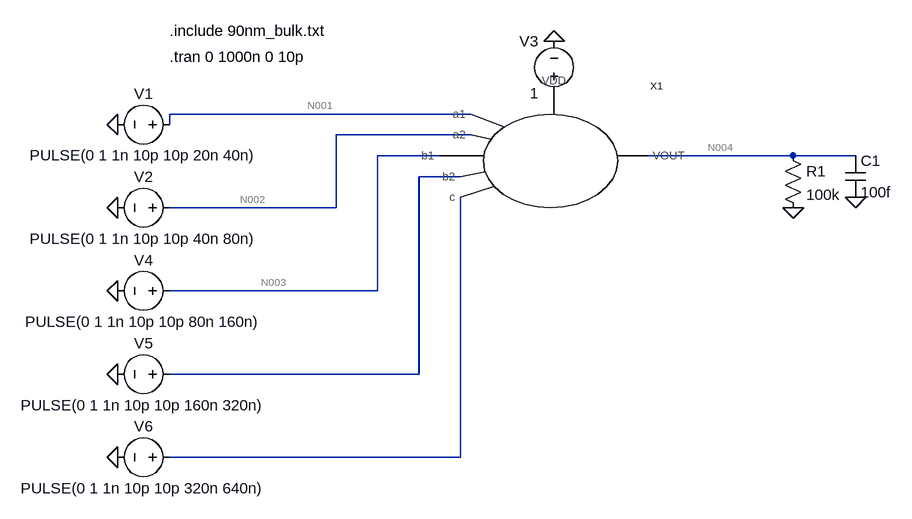
[diagram p0: schematic testcontroller.asc]
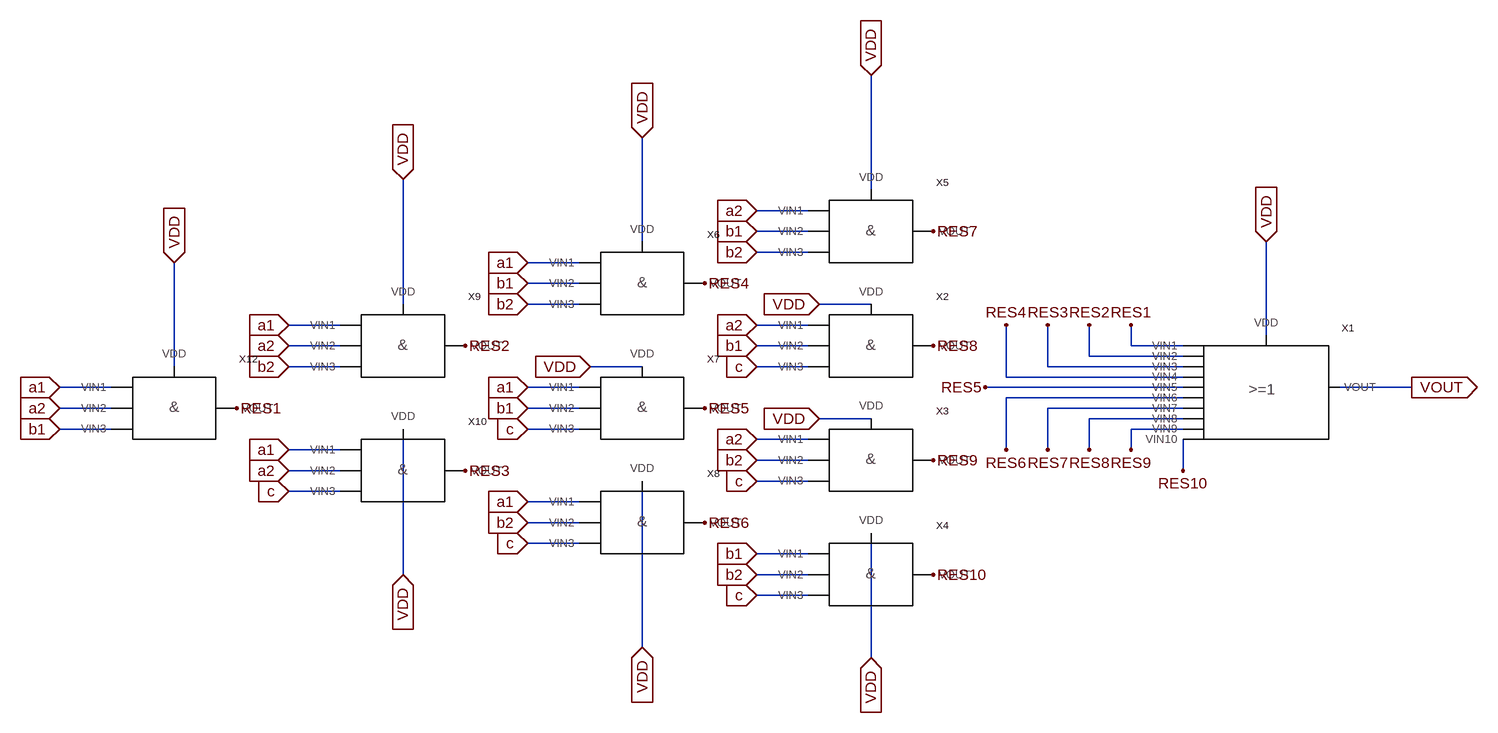
[diagram p1: sub-circuit dimamajorcontroller.asc]
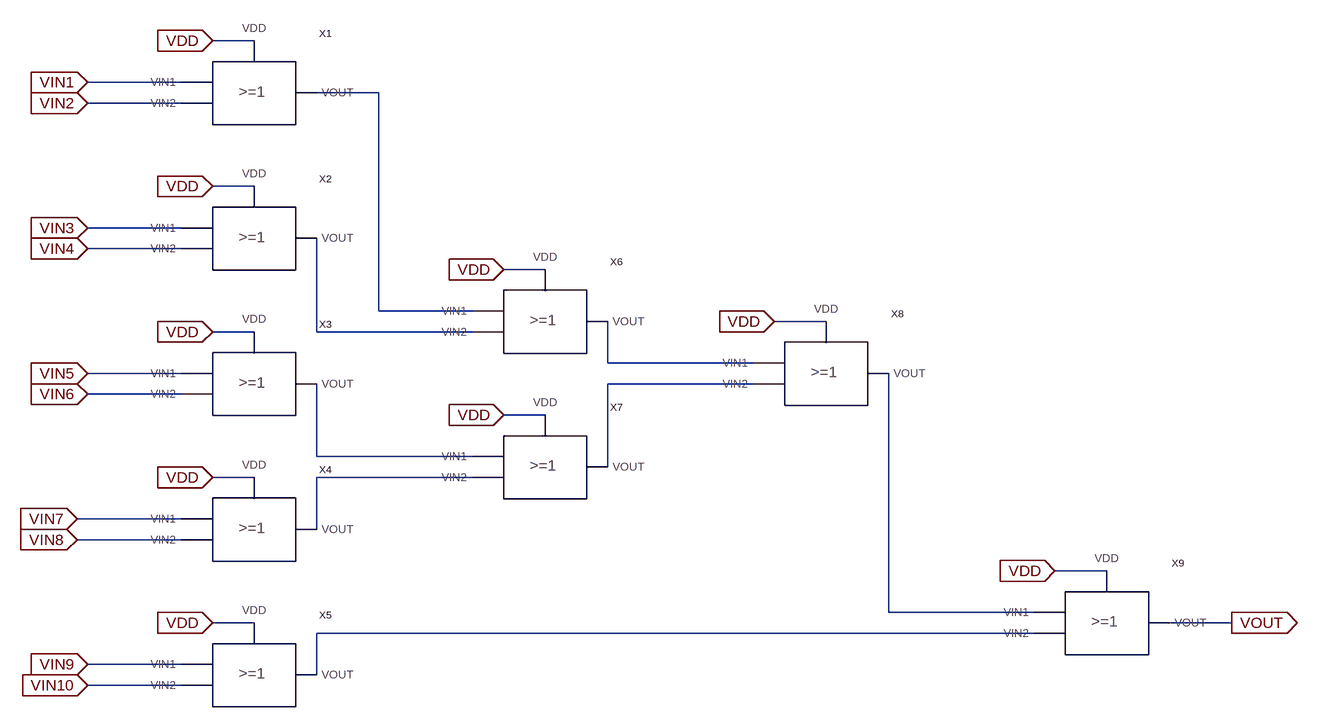
[diagram p2: sub-circuit dimatenor.asc]
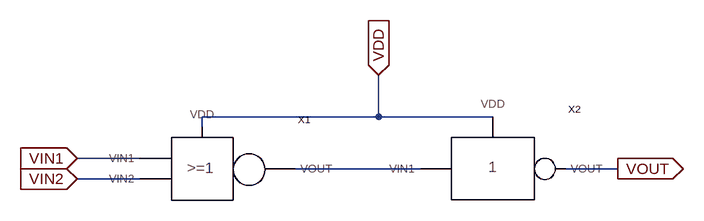
[diagram p3: sub-circuit dimaor.asc]
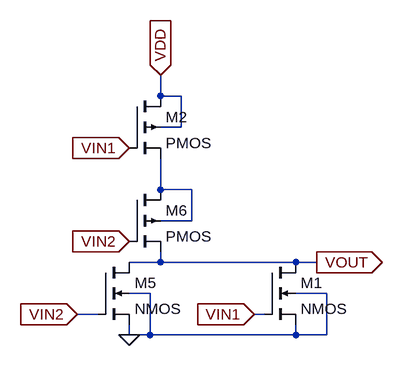
[diagram p4: sub-circuit dimanor.asc]
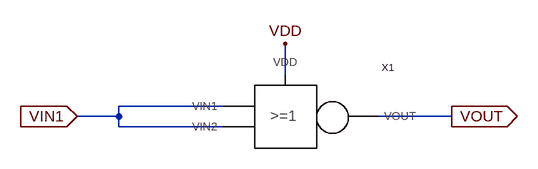
[diagram p5: sub-circuit dimanot.asc]
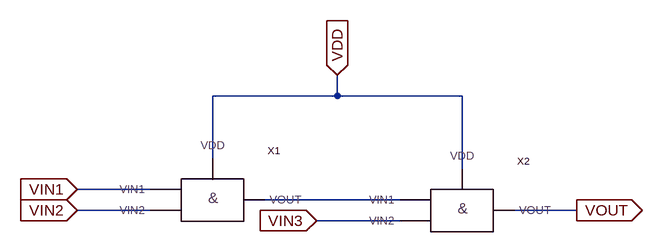
[diagram p6: sub-circuit dimatripleand.asc]
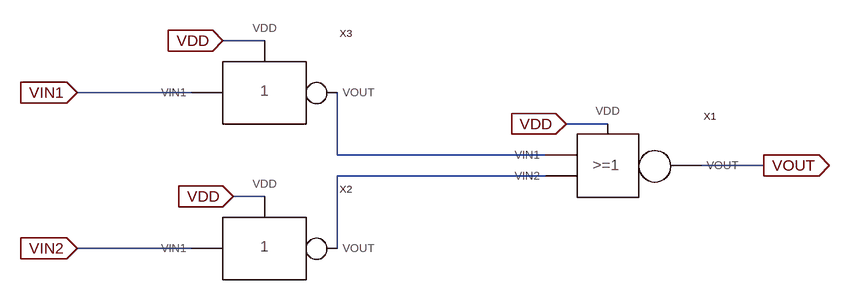
[diagram p7: sub-circuit dimaand.asc]
testcontroller.asc, the LTspice schematic file:
Version 4
SHEET 1 960 784
WIRE 304 128 -160 128
WIRE -160 144 -160 128
WIRE 304 160 96 160
WIRE 256 192 160 192
WIRE 800 192 576 192
WIRE 896 192 800 192
WIRE 288 224 224 224
WIRE 96 272 96 160
WIRE 96 272 -160 272
WIRE 160 400 160 192
WIRE 160 400 -160 400
WIRE 224 528 224 224
WIRE 224 528 -160 528
WIRE 288 656 288 256
WIRE 288 656 -160 656
FLAG -240 144 0
FLAG -240 272 0
FLAG 432 16 0
FLAG 800 272 0
FLAG 896 256 0
FLAG -240 400 0
FLAG -240 528 0
FLAG -240 656 0
SYMBOL voltage -144 144 R90
WINDOW 0 -32 56 VBottom 2
WINDOW 3 32 56 VTop 2
WINDOW 123 0 0 Left 0
WINDOW 39 0 0 Left 0
SYMATTR InstName V1
SYMATTR Value PULSE(0 1 1n 10p 10p 20n 40n)
SYMBOL voltage -144 272 R90
WINDOW 0 -32 56 VBottom 2
WINDOW 3 32 56 VTop 2
WINDOW 123 0 0 Left 0
WINDOW 39 0 0 Left 0
SYMATTR InstName V2
SYMATTR Value PULSE(0 1 1n 10p 10p 40n 80n)
SYMBOL voltage 432 112 R180
WINDOW 0 24 96 Left 2
WINDOW 3 24 16 Left 2
WINDOW 123 0 0 Left 0
WINDOW 39 0 0 Left 0
SYMATTR InstName V3
SYMATTR Value 1
SYMBOL cap 880 192 R0
SYMATTR InstName C1
SYMATTR Value 100f
SYMBOL res 784 176 R0
SYMATTR InstName R1
SYMATTR Value 100k
SYMBOL dimamajorcontroller 432 192 R0
SYMATTR InstName X1
SYMBOL voltage -144 400 R90
WINDOW 0 -32 56 VBottom 2
WINDOW 3 32 56 VTop 2
WINDOW 123 0 0 Left 0
WINDOW 39 0 0 Left 0
SYMATTR InstName V4
SYMATTR Value PULSE(0 1 1n 10p 10p 80n 160n)
SYMBOL voltage -144 528 R90
WINDOW 0 -32 56 VBottom 2
WINDOW 3 32 56 VTop 2
WINDOW 123 0 0 Left 0
WINDOW 39 0 0 Left 0
SYMATTR InstName V5
SYMATTR Value PULSE(0 1 1n 10p 10p 160n 320n)
SYMBOL voltage -144 656 R90
WINDOW 0 -32 56 VBottom 2
WINDOW 3 32 56 VTop 2
WINDOW 123 0 0 Left 0
WINDOW 39 0 0 Left 0
SYMATTR InstName V6
SYMATTR Value PULSE(0 1 1n 10p 10p 320n 640n)
TEXT -160 0 Left 2 !.include 90nm_bulk.txt
TEXT -160 40 Left 2 !.tran 0 1000n 0 10p

dimamajorcontroller.asc, the sub-circuit schematic file:
Version 4
SHEET 1 880 684
WIRE -336 -144 -336 -320
WIRE -432 -112 -512 -112
WIRE -432 -80 -512 -80
WIRE -688 -64 -688 -224
WIRE -432 -48 -512 -48
WIRE -784 -32 -864 -32
WIRE -784 0 -864 0
WIRE -1056 32 -1056 -160
WIRE -784 32 -864 32
WIRE -336 32 -416 32
WIRE -1152 64 -1232 64
WIRE -432 64 -512 64
WIRE 272 80 272 -64
WIRE -1152 96 -1232 96
WIRE -432 96 -512 96
WIRE 64 96 64 64
WIRE 144 96 64 96
WIRE 0 112 0 64
WIRE 144 112 0 112
WIRE -1408 128 -1408 -32
WIRE -1152 128 -1232 128
WIRE -688 128 -768 128
WIRE -432 128 -512 128
WIRE -64 128 -64 64
WIRE 144 128 -64 128
WIRE -128 144 -128 64
WIRE 144 144 -128 144
WIRE -1504 160 -1584 160
WIRE -784 160 -864 160
WIRE 144 160 -160 160
WIRE 496 160 384 160
WIRE 144 176 -128 176
WIRE -1504 192 -1584 192
WIRE -784 192 -864 192
WIRE 144 192 -64 192
WIRE -336 208 -416 208
WIRE 144 208 0 208
WIRE -1504 224 -1584 224
WIRE -784 224 -864 224
WIRE 144 224 64 224
WIRE -432 240 -512 240
WIRE -1152 256 -1232 256
WIRE -128 256 -128 176
WIRE -64 256 -64 192
WIRE 0 256 0 208
WIRE 64 256 64 224
WIRE -432 272 -512 272
WIRE -1152 288 -1232 288
WIRE 144 288 144 240
WIRE -432 304 -512 304
WIRE -1152 320 -1232 320
WIRE -784 336 -864 336
WIRE -784 368 -864 368
WIRE -784 400 -864 400
WIRE -432 416 -512 416
WIRE -1056 448 -1056 224
WIRE -432 448 -512 448
WIRE -432 480 -512 480
WIRE -688 560 -688 304
WIRE -336 576 -336 384
FLAG -1584 160 a1
IOPIN -1584 160 In
FLAG -1584 192 a2
IOPIN -1584 192 In
FLAG -1584 224 b1
IOPIN -1584 224 In
FLAG -1312 192 RES1
FLAG -960 96 RES2
FLAG -1232 64 a1
IOPIN -1232 64 In
FLAG -1232 96 a2
IOPIN -1232 96 In
FLAG -1232 128 b2
IOPIN -1232 128 In
FLAG -1232 256 a1
IOPIN -1232 256 In
FLAG -1232 288 a2
IOPIN -1232 288 In
FLAG -1232 320 c
IOPIN -1232 320 In
FLAG -960 288 RES3
FLAG -864 -32 a1
IOPIN -864 -32 In
FLAG -864 0 b1
IOPIN -864 0 In
FLAG -864 32 b2
IOPIN -864 32 In
FLAG -864 160 a1
IOPIN -864 160 In
FLAG -864 192 b1
IOPIN -864 192 In
FLAG -864 224 c
IOPIN -864 224 In
FLAG -864 336 a1
IOPIN -864 336 In
FLAG -864 368 b2
IOPIN -864 368 In
FLAG -864 400 c
IOPIN -864 400 In
FLAG -592 0 RES4
FLAG -592 192 RES5
FLAG -592 368 RES6
FLAG -512 -112 a2
IOPIN -512 -112 In
FLAG -512 -80 b1
IOPIN -512 -80 In
FLAG -512 -48 b2
IOPIN -512 -48 In
FLAG -512 64 a2
IOPIN -512 64 In
FLAG -512 96 b1
IOPIN -512 96 In
FLAG -512 128 c
IOPIN -512 128 In
FLAG -512 240 a2
IOPIN -512 240 In
FLAG -512 272 b2
IOPIN -512 272 In
FLAG -512 304 c
IOPIN -512 304 In
FLAG -512 416 b1
IOPIN -512 416 In
FLAG -512 448 b2
IOPIN -512 448 In
FLAG -512 480 c
IOPIN -512 480 In
FLAG -240 -80 RES7
FLAG -240 96 RES8
FLAG -240 272 RES9
FLAG -240 448 RES10
FLAG -1408 -32 VDD
IOPIN -1408 -32 In
FLAG -1056 -160 VDD
IOPIN -1056 -160 In
FLAG -1056 448 VDD
IOPIN -1056 448 In
FLAG -688 -224 VDD
IOPIN -688 -224 In
FLAG -768 128 VDD
IOPIN -768 128 In
FLAG -688 560 VDD
IOPIN -688 560 In
FLAG -336 -320 VDD
IOPIN -336 -320 In
FLAG -416 32 VDD
IOPIN -416 32 In
FLAG -416 208 VDD
IOPIN -416 208 In
FLAG -336 576 VDD
IOPIN -336 576 In
FLAG 272 -64 VDD
IOPIN 272 -64 In
FLAG 64 64 RES1
FLAG 0 64 RES2
FLAG -64 64 RES3
FLAG -128 64 RES4
FLAG -160 160 RES5
FLAG -128 256 RES6
FLAG -64 256 RES7
FLAG 0 256 RES8
FLAG 64 256 RES9
FLAG 144 288 RES10
FLAG 496 160 VOUT
IOPIN 496 160 Out
SYMBOL dimatenor 272 160 R0
SYMATTR InstName X1
SYMBOL dimatripleand -336 96 R0
SYMATTR InstName X2
SYMBOL dimatripleand -336 272 R0
SYMATTR InstName X3
SYMBOL dimatripleand -336 448 R0
SYMATTR InstName X4
SYMBOL dimatripleand -336 -80 R0
SYMATTR InstName X5
SYMBOL dimatripleand -688 0 R0
SYMATTR InstName X6
SYMBOL dimatripleand -688 192 R0
SYMATTR InstName X7
SYMBOL dimatripleand -688 368 R0
SYMATTR InstName X8
SYMBOL dimatripleand -1056 96 R0
SYMATTR InstName X9
SYMBOL dimatripleand -1056 288 R0
SYMATTR InstName X10
SYMBOL dimatripleand -1408 192 R0
SYMATTR InstName X12

dimatenor.asc, the sub-circuit schematic file:
Version 4
SHEET 1 1980 952
WIRE 336 -176 272 -176
WIRE 224 -112 80 -112
WIRE 528 -96 432 -96
WIRE 224 -80 80 -80
WIRE 336 48 272 48
WIRE 224 112 80 112
WIRE 224 144 80 144
WIRE 784 176 720 176
WIRE 528 240 528 -96
WIRE 672 240 528 240
WIRE 1216 256 1136 256
WIRE 336 272 272 272
WIRE 432 272 432 128
WIRE 672 272 432 272
WIRE 880 320 880 256
WIRE 1104 320 880 320
WIRE 224 336 80 336
WIRE 1104 352 880 352
WIRE 224 368 80 368
WIRE 784 400 720 400
WIRE 432 464 432 352
WIRE 672 464 432 464
WIRE 880 480 880 352
WIRE 336 496 272 496
WIRE 672 496 432 496
WIRE 224 560 64 560
WIRE 432 576 432 496
WIRE 224 592 64 592
WIRE 1648 640 1568 640
WIRE 1312 704 1312 336
WIRE 1536 704 1312 704
WIRE 336 720 272 720
WIRE 1840 720 1744 720
WIRE 1536 736 432 736
WIRE 224 784 80 784
WIRE 432 800 432 736
WIRE 224 816 80 816
FLAG 80 -112 VIN1
IOPIN 80 -112 In
FLAG 80 -80 VIN2
IOPIN 80 -80 In
FLAG 80 112 VIN3
IOPIN 80 112 In
FLAG 80 144 VIN4
IOPIN 80 144 In
FLAG 80 336 VIN5
IOPIN 80 336 In
FLAG 80 368 VIN6
IOPIN 80 368 In
FLAG 64 560 VIN7
IOPIN 64 560 In
FLAG 64 592 VIN8
IOPIN 64 592 In
FLAG 80 784 VIN9
IOPIN 80 784 In
FLAG 80 816 VIN10
IOPIN 80 816 In
FLAG 272 -176 VDD
IOPIN 272 -176 In
FLAG 1840 720 VOUT
IOPIN 1840 720 Out
FLAG 272 272 VDD
IOPIN 272 272 In
FLAG 272 496 VDD
IOPIN 272 496 In
FLAG 272 720 VDD
IOPIN 272 720 In
FLAG 720 400 VDD
IOPIN 720 400 In
FLAG 720 176 VDD
IOPIN 720 176 In
FLAG 1136 256 VDD
IOPIN 1136 256 In
FLAG 1568 640 VDD
IOPIN 1568 640 In
FLAG 272 48 VDD
IOPIN 272 48 In
SYMBOL dimaor 336 -96 R0
SYMATTR InstName X1
SYMBOL dimaor 336 128 R0
SYMATTR InstName X2
SYMBOL dimaor 336 352 R0
SYMATTR InstName X3
SYMBOL dimaor 336 576 R0
SYMATTR InstName X4
SYMBOL dimaor 336 800 R0
SYMATTR InstName X5
SYMBOL dimaor 784 256 R0
SYMATTR InstName X6
SYMBOL dimaor 784 480 R0
SYMATTR InstName X7
SYMBOL dimaor 1216 336 R0
SYMATTR InstName X8
SYMBOL dimaor 1648 720 R0
SYMATTR InstName X9

dimaor.asc, the sub-circuit schematic file:
Version 4
SHEET 1 880 680
WIRE 336 112 336 48
WIRE 336 112 64 112
WIRE 512 112 336 112
WIRE 64 128 64 112
WIRE -32 176 -128 176
WIRE 400 192 208 192
WIRE 704 192 624 192
WIRE -32 208 -128 208
FLAG 336 48 VDD
IOPIN 336 48 In
FLAG 704 192 VOUT
IOPIN 704 192 Out
FLAG -128 176 VIN1
IOPIN -128 176 In
FLAG -128 208 VIN2
IOPIN -128 208 In
SYMBOL dimanor 64 176 R0
SYMATTR InstName X1
SYMBOL dimanot 512 192 R0
SYMATTR InstName X2

dimanor.asc, the sub-circuit schematic file:
Version 4
SHEET 1 880 680
WIRE 464 64 464 32
WIRE 496 64 464 64
WIRE 496 112 496 64
WIRE 496 112 464 112
WIRE 464 208 464 160
WIRE 512 208 464 208
WIRE 512 256 512 208
WIRE 512 256 464 256
WIRE 464 320 464 304
WIRE 464 320 416 320
WIRE 672 320 464 320
WIRE 704 320 672 320
WIRE 448 368 416 368
WIRE 720 368 672 368
WIRE 368 400 336 400
WIRE 624 400 608 400
WIRE 416 432 416 416
WIRE 448 432 448 368
WIRE 448 432 416 432
WIRE 672 432 672 416
WIRE 672 432 448 432
WIRE 720 432 720 368
WIRE 720 432 672 432
FLAG 416 144 VIN1
IOPIN 416 144 In
FLAG 416 288 VIN2
IOPIN 416 288 In
FLAG 608 400 VIN1
IOPIN 608 400 In
FLAG 336 400 VIN2
IOPIN 336 400 In
FLAG 416 432 0
FLAG 464 32 VDD
IOPIN 464 32 In
FLAG 704 320 VOUT
IOPIN 704 320 Out
SYMBOL nmos4 368 320 R0
SYMATTR InstName M5
SYMATTR Value2 l=90n w=200n
SYMBOL nmos4 624 320 R0
SYMATTR InstName M1
SYMATTR Value2 l=90n w=200n
SYMBOL pmos4 416 64 R0
SYMATTR InstName M2
SYMATTR Value2 l=90n w=400n
SYMBOL pmos4 416 208 R0
SYMATTR InstName M6
SYMATTR Value2 l=90n w=400n

dimanot.asc, the sub-circuit schematic file:
Version 4
SHEET 1 880 680
WIRE 272 112 272 64
WIRE 176 160 16 160
WIRE 16 176 16 160
WIRE 16 176 -48 176
WIRE 528 176 416 176
WIRE 16 192 16 176
WIRE 176 192 16 192
FLAG -48 176 VIN1
IOPIN -48 176 In
FLAG 272 64 VDD
FLAG 528 176 VOUT
IOPIN 528 176 Out
SYMBOL dimanor 272 160 R0
SYMATTR InstName X1

dimatripleand.asc, the sub-circuit schematic file:
Version 4
SHEET 1 880 680
WIRE 256 0 256 -32
WIRE 256 0 64 0
WIRE 448 0 256 0
WIRE 64 96 64 0
WIRE 448 112 448 0
WIRE -32 144 -144 144
WIRE 352 160 144 160
WIRE -32 176 -144 176
WIRE 624 176 528 176
WIRE 352 192 224 192
FLAG 224 192 VIN3
IOPIN 224 192 In
FLAG -144 144 VIN1
IOPIN -144 144 In
FLAG -144 176 VIN2
IOPIN -144 176 In
FLAG 256 -32 VDD
IOPIN 256 -32 In
FLAG 624 176 VOUT
IOPIN 624 176 Out
SYMBOL dimaand 64 160 R0
SYMATTR InstName X1
SYMBOL dimaand 448 176 R0
SYMATTR InstName X2

dimaand.asc, the sub-circuit schematic file:
Version 4
SHEET 1 880 680
WIRE -176 0 -240 0
WIRE -288 80 -464 80
WIRE 352 128 288 128
WIRE -64 176 -64 80
WIRE 256 176 -64 176
WIRE 592 192 496 192
WIRE 256 208 -64 208
WIRE -176 240 -224 240
WIRE -288 320 -464 320
WIRE -64 320 -64 208
FLAG -240 0 VDD
IOPIN -240 0 In
FLAG -464 320 VIN2
IOPIN -464 320 In
FLAG -464 80 VIN1
IOPIN -464 80 In
FLAG 592 192 VOUT
IOPIN 592 192 Out
FLAG 288 128 VDD
IOPIN 288 128 In
FLAG -224 240 VDD
IOPIN -224 240 In
SYMBOL dimanor 352 176 R0
SYMATTR InstName X1
SYMBOL dimanot -176 320 R0
SYMATTR InstName X2
SYMBOL dimanot -176 80 R0
SYMATTR InstName X3

The netlist it stands for:
* testcontroller.asc
V1 N001 0 PULSE(0 1 1n 10p 10p 20n 40n)
V2 N002 0 PULSE(0 1 1n 10p 10p 40n 80n)
V3 P001 0 1
C1 N004 0 100f
R1 N004 0 100k
XX1 N001 N002 N003 N005 N006 P001 N004 dimamajorcontroller
V4 N003 0 PULSE(0 1 1n 10p 10p 80n 160n)
V5 N005 0 PULSE(0 1 1n 10p 10p 160n 320n)
V6 N006 0 PULSE(0 1 1n 10p 10p 320n 640n)

* block symbol definitions
.subckt dimamajorcontroller a1 a2 b1 b2 c VDD VOUT
XX1 VOUT VDD RES1 RES2 RES3 RES4 RES5 RES6 RES7 RES8 RES9 RES10 dimatenor
XX2 a2 b1 c VDD RES8 dimatripleand
XX3 a2 b2 c VDD RES9 dimatripleand
XX4 b1 b2 c VDD RES10 dimatripleand
XX5 a2 b1 b2 VDD RES7 dimatripleand
XX6 a1 b1 b2 VDD RES4 dimatripleand
XX7 a1 b1 c VDD RES5 dimatripleand
XX8 a1 b2 c VDD RES6 dimatripleand
XX9 a1 a2 b2 VDD RES2 dimatripleand
XX10 a1 a2 c VDD RES3 dimatripleand
XX12 a1 a2 b1 VDD RES1 dimatripleand
.ends dimamajorcontroller

.subckt dimatenor VOUT VDD VIN1 VIN2 VIN3 VIN4 VIN5 VIN6 VIN7 VIN8 VIN9 VIN10
XX1 VIN1 VIN2 VDD N001 dimaor
XX2 VIN3 VIN4 VDD N002 dimaor
XX3 VIN5 VIN6 VDD N005 dimaor
XX4 VIN7 VIN8 VDD N006 dimaor
XX5 VIN9 VIN10 VDD N008 dimaor
XX6 N001 N002 VDD N003 dimaor
XX7 N005 N006 VDD N004 dimaor
XX8 N003 N004 VDD N007 dimaor
XX9 N007 N008 VDD VOUT dimaor
.ends dimatenor

.subckt dimaor VIN1 VIN2 VDD VOUT
XX1 VIN1 VIN2 VDD N001 dimanor
XX2 N001 VDD VOUT dimanot
.ends dimaor

.subckt dimanor VIN1 VIN2 VDD VOUT
M5 VOUT VIN2 0 0 NMOS l=90n w=200n
M1 VOUT VIN1 0 0 NMOS l=90n w=200n
M2 VDD VIN1 N001 VDD PMOS l=90n w=400n
M6 N001 VIN2 VOUT N001 PMOS l=90n w=400n
.ends dimanor

.subckt dimanot VIN1 VDD VOUT
XX1 VIN1 VIN1 VDD VOUT dimanor
.ends dimanot

.subckt dimatripleand VIN1 VIN2 VIN3 VDD VOUT
XX1 VIN1 VIN2 VDD N001 dimaand
XX2 N001 VIN3 VDD VOUT dimaand
.ends dimatripleand

.subckt dimaand VIN1 VIN2 VDD VOUT
XX1 N001 N002 VDD VOUT dimanor
XX2 VIN2 VDD N002 dimanot
XX3 VIN1 VDD N001 dimanot
.ends dimaand

.model NMOS NMOS
.model PMOS PMOS
.lib standard.mos
.include 90nm_bulk.txt
.tran 0 1000n 0 10p
.backanno
.end

* Results of the author's LTspice run, read from the files saved beside the schematic
* Operating Point, zero values left out:
*   V(p001) = 1 V
*   V(n004) = 681 nV
*   I(R1) = 6.81 pA
*   I(V6) = 1.57 nA
*   I(V5) = 1.57 nA
*   I(V4) = 1.57 nA
*   I(V3) = -556.4 nA
*   I(V2) = 1.57 nA
*   I(V1) = 1.57 nA
*   Ix(x1:A1) = -1.57 nA
*   Ix(x1:A2) = -1.57 nA
*   Ix(x1:B1) = -1.57 nA
*   Ix(x1:B2) = -1.57 nA
*   Ix(x1:C) = -1.57 nA
*   Ix(x1:VDD) = 556.4 nA
*   Ix(x1:VOUT) = -6.81 pA
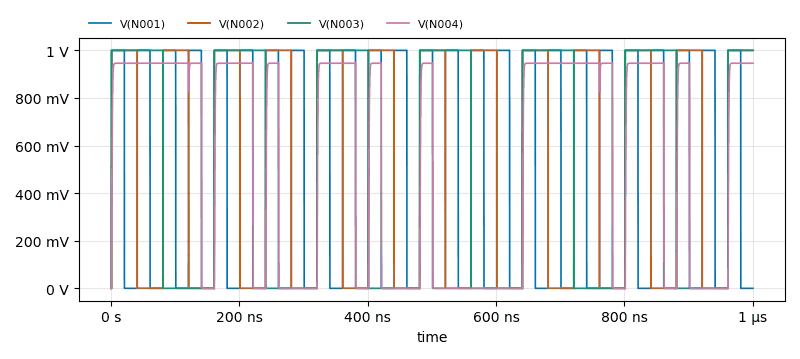
[diagram p8: Transient Analysis of testcontroller.asc, plotted from the saved traces]
* Transient Analysis, 1 run:
*   V(N001): min 0 V, max 1 V, average 500.3 mV, rms 707.2 mV, last 0 V
*   V(N002): min 0 V, max 1 V, average 519.1 mV, rms 720.5 mV, last 1 V
*   V(N003): min 0 V, max 1 V, average 519.1 mV, rms 720.4 mV, last 1 V
*   V(N004): min -2.068 mV, max 946.7 mV, average 540.7 mV, rms 712.3 mV, last 945.9 mV